# EAGLE schematic martinez (EAGLE 8.0.2)
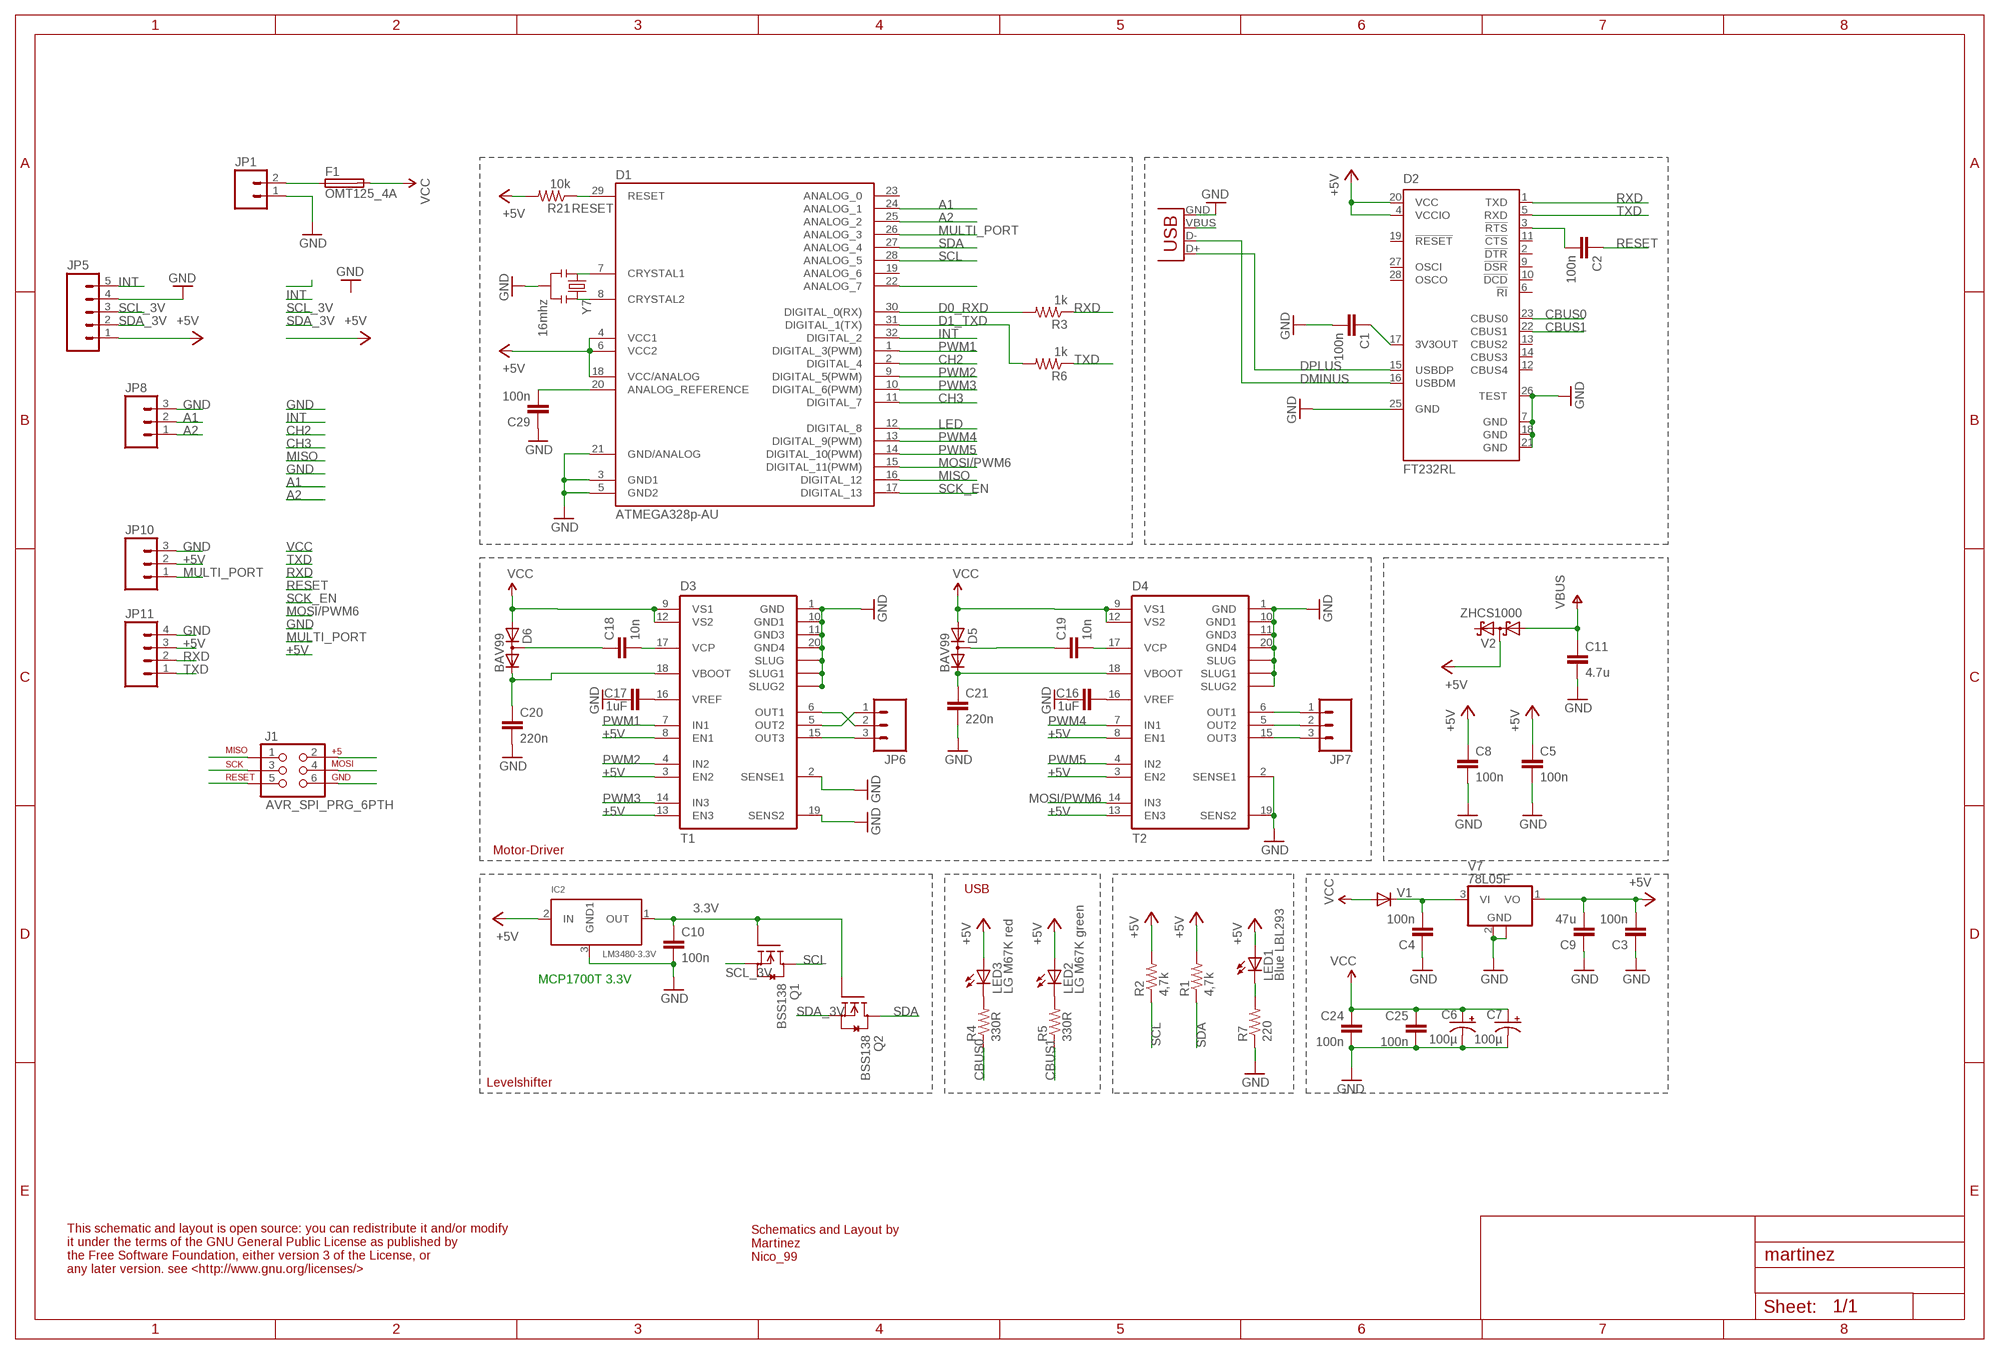
[diagram p0: schematic, sheet 1]

## Parts
C1  100n  CAP0805  [0805]
C2  100n  CAP0805  [0805]
C3  100n  CAP0805  [0805]
C4  100n  CAP0805  [0805]
C5  100n  CAP0805  [0805]
C6  100µ  CAP_POLD  [PANASONIC_D]
C7  100µ  CAP_POLD  [PANASONIC_D]
C8  100n  CAP0805  [0805]
C9  47u  C-EUC1210  [C1210]
C10  100n  CAP0805  [0805]
C11  4.7u  CAP0805  [0805]
C16  1uF  CAP0805  [0805]
C17  1uF  CAP0805  [0805]
C18  10n  CAP0805  [0805]
C19  10n  CAP0805  [0805]
C20  220n  CAP0805  [0805]
C21  220n  CAP0805  [0805]
C24  100n  CAP0805  [0805]
C25  100n  CAP0805  [0805]
C29  100n  CAP0805  [0805]
D1  ATMEGA328p-AU  ATMEGA168-AU  [TQFP32-08]
D2  FT232RL  [SSOP28]
D3  T1  L6234  [SO20POWER2]
D4  T2  L6234  [SO20POWER2]
D5  BAV99  BAV199  [SOT23]
D6  BAV99  BAV199  [SOT23]
F1  OMT125_4A  OMT125_11MM  [OMT125_11MM]
IC2  LM3480-3.3V  VREG_MULTI2  [SOT23]
J1  AVR_SPI_PRG_6PTH  [2X3]
JP1  M02PTH  [1X02]
JP5  M05PTH  [1X05]
JP6  M03PTH  [1X03]
JP7  M03PTH  [1X03]
JP8  M031X03_NO_SILK  [1X03_NO_SILK]
JP10  M031X03_NO_SILK  [1X03_NO_SILK]
JP11  M041X04_NO_SILK  [1X04_NO_SILK]
LED1  Blue LBL293  LEDCHIP-LED0603  [CHIP-LED0603]
LED2  LG M67K green  LEDCHIP-LED0805  [CHIP-LED0805]
LED3  LG M67K red  LEDCHIP-LED0805  [CHIP-LED0805]
Q1  BSS138  [SOT23]
Q2  BSS138  [SOT23]
R1  4,7k  RESISTOR0805-RES  [0805]
R2  4,7k  RESISTOR0805-RES  [0805]
R3  1k  RESISTOR0805-RES  [0805]
R4  330R  RESISTOR0805-RES  [0805]
R5  330R  RESISTOR0805-RES  [0805]
R6  1k  RESISTOR0805-RES  [0805]
R7  220  RESISTOR0805-RES  [0805]
R21  10k  RESISTOR0805-RES  [0805]
V1  DIODE-DO214AC  [DO214AC]
V2  ZHCS1000  BAS40-04  [SOT23]
V7  78L05F  [SOT89]
X2  USBOLD  [USB-MINIB-OLD]
Y7  16mhz  RESONATORSMD  [RESONATOR-SMD]

## Nets
3.3V: C10.1 IC2.1(OUT) Q1.1(G) Q2.1(G)
+5V: C3.2 C5.1 C8.1 C9.2 D1.4(VCC1) D1.6(VCC2) D1.18(VCC/ANALOG) D2.4(VCCIO) D2.20(VCC) D3.3(EN2) D3.8(EN1) D3.13(EN3) D4.3(EN2) D4.8(EN1) D4.13(EN3) IC2.2(IN) J1.2 JP5.1 JP10.2 JP11.3 LED1.A LED2.A LED3.A R1.2 R2.2 R21.2 V2.3(C1A2) V7.1(VO)
A1: D1.24(ANALOG_1) JP8.2
A2: D1.25(ANALOG_2) JP8.1
A7: D1.22(ANALOG_7)
CBUS0: D2.23(CBUS0) R4.1
CBUS1: D2.22(CBUS1) R5.1
CH2: D1.2(DIGITAL_4)
CH3: D1.11(DIGITAL_7)
D0_RXD: D1.30(DIGITAL_0(RX)) R3.2
D1_TXD: D1.31(DIGITAL_1(TX)) R6.2
DMINUS: D2.16(USBDM) X2.D-
DPLUS: D2.15(USBDP) X2.D+
GND: C1.2 C3.1 C4.1 C5.2 C6.- C7.- C8.2 C9.1 C10.2 C11.2 C16.1 C17.1 C20.2 C21.2 C24.2 C25.2 C29.1 D1.3(GND1) D1.5(GND2) D1.21(GND/ANALOG) D2.7(GND) D2.18(GND) D2.21(GND) D2.25(GND) D2.26(TEST) D3.1(GND) D3.2(SENSE1) D3.10(GND1) D3.11(GND3) D3.19(SENS2) D3.20(GND4) D3.SLUG1(SLUG2) D3.SLUG2(SLUG) D3.SLUG(SLUG1) D4.1(GND) D4.2(SENSE1) D4.10(GND1) D4.11(GND3) D4.19(SENS2) D4.20(GND4) D4.SLUG1(SLUG2) D4.SLUG2(SLUG) D4.SLUG(SLUG1) IC2.3(GND1) J1.6 JP1.1 JP5.4 JP8.3 JP10.3 JP11.4 R7.1 V7.2(GND) V7.2@1(GND) X2.GND Y7.2
INT: D1.32(DIGITAL_2) JP5.5
LED: D1.12(DIGITAL_8)
MISO: D1.16(DIGITAL_12) J1.1
MOSI/PWM6: D1.15(DIGITAL_11(PWM)) D4.14(IN3) J1.4
MULTI_PORT: D1.26(ANALOG_3) JP10.1
N$1: LED3.C R4.2
N$2: LED2.C R5.2
N$3: F1.P$1 JP1.2
N$4: LED1.C R7.2
N$7: C16.2 D4.16(VREF)
N$8: C17.2 D3.16(VREF)
N$17: C18.2 D3.17(VCP)
N$18: C19.2 D4.17(VCP)
N$19: C19.1 D5.3(AC)
N$20: C21.1 D4.18(VBOOT) D5.2(C)
N$21: D3.15(OUT3) JP6.3
N$22: C1.1 D2.17(3V3OUT)
N$23: D4.6(OUT1) JP7.1
N$24: D4.5(OUT2) JP7.2
N$25: D4.15(OUT3) JP7.3
N$26: C2.2 D2.3(!RTS)
N$27: D3.5(OUT2) JP6.1
N$28: D3.6(OUT1) JP6.2
N$38: D1.8(CRYSTAL2) Y7.3
N$39: D1.7(CRYSTAL1) Y7.1
N$40: C29.2 D1.20(ANALOG_REFERENCE)
PWM1: D1.1(DIGITAL_3(PWM)) D3.7(IN1)
PWM2: D1.9(DIGITAL_5(PWM)) D3.4(IN2)
PWM3: D1.10(DIGITAL_6(PWM)) D3.14(IN3)
PWM4: D1.13(DIGITAL_9(PWM)) D4.7(IN1)
PWM5: D1.14(DIGITAL_10(PWM)) D4.4(IN2)
RESET: C2.1 D1.29(RESET) J1.5 R21.1
RXD: D2.1(TXD) JP11.2 R3.1
SCK_EN: D1.17(DIGITAL_13) J1.3
SCL: D1.28(ANALOG_5) Q1.3(D) R2.1
SCL_3V: JP5.3 Q1.2(S)
SDA: D1.27(ANALOG_4) Q2.3(D) R1.1
SDA_3V: JP5.2 Q2.2(S)
TXD: D2.5(RXD) JP11.1 R6.1
VBOOT1: C20.1 D3.18(VBOOT) D6.2(C)
VBUS: C11.1 V2.1(A1) X2.VBUS
VCC: C6.+ C7.+ C24.1 C25.1 D3.9(VS1) D3.12(VS2) D4.9(VS1) D4.12(VS2) D5.1(A) D6.1(A) F1.P$2 V1.A
VCC_VI: C4.2 V1.C V7.3(VI)
VCP1: C18.1 D6.3(AC)
Unconnected: D1.19(ANALOG_6) D1.23(ANALOG_0) D2.2(!DTR) D2.6(!RI) D2.9(!DSR) D2.10(!DCD) D2.11(!CTS) D2.12(CBUS4) D2.13(CBUS2) D2.14(CBUS3) D2.19(!RESET) D2.27(OSCI) D2.28(OSCO) V2.2(C2)

## Notes on the sheet
- FTDI
- Motor-Driver
- USB
- MCP1700T 3.3V
- Levelshifter
- Schematics and Layout by
  Martinez
  Nico_99
- This schematic and layout is open source: you can redistribute it and/or modify
  it under the terms of the GNU General Public License as published by
  the Free Software Foundation, either version 3 of the License, or
  any later version. see <http://www.gnu.org/licenses/>

## Library data of the parts
C1-C5 C8 C10 C11 C16-C21 C24 C25 C29 = SparkFun:CAP: Capacitor Standard 0603 ceramic capacitor, and 0.1" leaded capacitor.
C6 C7 = SparkFun:CAP_POL: Capacitor Polarized These are standard SMD and PTH capacitors. Normally 10uF, 47uF, and 100uF in electrolytic and tantalum varieties. Always verify the external diameter of the through hole cap, it varies with capacity, voltage, and manufacturer. The EIA devices should be standard.
C9 = rcl:C-EU: CAPACITOR, European symbol
D1 = Arduino-AVR:ATMEGA168
D2 = ftdichip:FT232R: Source: http://www.ftdichip.com/Documents/DataSheets/DS_FT232R_v104.pdf; MPN: FT232RL; OC_FARNELL: 1146032; OC_NEWARK: 91K9918
D3 D4 = L6234:L6234
D5 D6 = diode:BAV199: DIODE low-leakage double diode
F1 = fuse:OMT125_11MM
IC2 = m-pad-2.1_my:VREG_MULTI2: standard package voltage regulator (LM3480, etc)
J1 = SparkFun:AVR_SPI_PRG_6: AVR ISP 6 Pin This is the reduced ISP connector for AVR programming. Common on Arduino. This footprint will take up less PCB space and can be used with a 10-pin to 6-pin adapter such as SKU: BOB-08508
JP1 = SparkFun:M02: Header 2 Standard 2-pin 0.1" header. Use with straight break away headers (SKU : PRT-00116), right angle break away headers (PRT-00553), swiss pins (PRT-00743), machine pins (PRT-00117), and female headers (PRT-00115). Molex polarized connector foot print use with SKU : PRT-08233 with associated crimp pins and housings.
JP5 = SparkFun:M05: Header 5 Standard 5-pin 0.1" header. Use with straight break away headers (SKU : PRT-00116), right angle break away headers (PRT-00553), swiss pins (PRT-00743), machine pins (PRT-00117), and female headers (PRT-00115). Molex polarized connector foot print use with SKU : PRT-08230 with associated crimp pins and housings.
JP6-JP8 JP10 = SparkFun:M03: Header 3 Standard 3-pin 0.1" header. Use with straight break away headers (SKU : PRT-00116), right angle break away headers (PRT-00553), swiss pins (PRT-00743), machine pins (PRT-00117), and female headers (PRT-00115). Molex polarized connector foot print use with SKU : PRT-08232 with associated crimp pins and housings.
JP11 = SparkFun:M04: Header 4 Standard 4-pin 0.1" header. Use with straight break away headers (SKU : PRT-00116), right angle break away headers (PRT-00553), swiss pins (PRT-00743), machine pins (PRT-00117), and female headers (PRT-00115). Molex polarized connector foot print use with SKU : PRT-08231 with associated crimp pins and housings. 1MM SMD Version SKU: PRT-10208
LED1-LED3 = led:LED: LED OSRAM: - CHIPLED LG R971, LG N971, LY N971, LG Q971, LY Q971, LO R971, LY R971 LH N974, LH R974 LS Q976, LO Q976, LY Q976 LO Q996 - Hyper CHIPLED LW Q18S LB Q993, LB Q99A, LB R99A - SideLED LS A670, LO A670, LY A670, LG A670, LP A670 LB A673, LV A673, LT A673, LW A673 LH A674 LY A675 LS A676, LA A676, LO A676, LY A676, LW A676 LS A679, LY A679, LG A679 - Hyper Micro SIDELED® LS Y876, LA Y876, LO Y876, LY Y876 LT Y87S - SmartLED LW L88C, LW L88S LB L89C, LB L89S, LG L890 LS L89K, LO L89K, LY L89K LS L896, LA L896, LO L896, LY L896 - TOPLED LS T670, LO T670, LY T670, LG T670, LP T670 LSG T670, LSP T670, LSY T670, LOP T670, LYG T670 LG T671, LOG T671, LSG T671 LB T673, LV T673, LT T673, LW T673 LH T674 LS T676, LA T676, LO T676, LY T676, LB T676, LH T676, LSB T676, LW T676 LB T67C, LV T67C, LT T67C, LS T67K, LO T67K, LY T67K, LW E67C LS E67B, LA E67B, LO E67B, LY E67B, LB E67C, LV E67C, LT E67C LW T67C LS T679, LY T679, LG T679 LS T770, LO T770, LY T770, LG T770, LP T770 LB T773, LV T773, LT T773, LW T773 LH T774 LS E675, LA E675, LY E675, LS T675 LS T776, LA T776, LO T776, LY T776, LB T776 LHGB T686 LT T68C, LB T68C - Hyper Mini TOPLED® LB M676 - Mini TOPLED Santana® LG M470 LS M47K, LO M47K, LY M47K Source: http://www.osram.convergy.de LUXEON: - LUMILED® LXK2-PW12-R00, LXK2-PW12-S00, LXK2-PW14-U00, LXK2-PW14-V00 LXK2-PM12-R00, LXK2-PM12-S00, LXK2-PM14-U00 LXK2-PE12-Q00, LXK2-PE12-R00, LXK2-PE12-S00, LXK2-PE14-T00, LXK2-PE14-U00 LXK2-PB12-K00, LXK2-PB12-L00, LXK2-PB12-M00, LXK2-PB14-N00, LXK2-PB14-P00, LXK2-PB14-Q00 LXK2-PR12-L00, LXK2-PR12-M00, LXK2-PR14-Q00, LXK2-PR14-R00 LXK2-PD12-Q00, LXK2-PD12-R00, LXK2-PD12-S00 LXK2-PH12-R00, LXK2-PH12-S00 LXK2-PL12-P00, LXK2-PL12-Q00, LXK2-PL12-R00 Source: www.luxeon.com KINGBRIGHT: KA-3528ASYC Source: www.kingbright.com
Q1 Q2 = m-pad-2.1_my:BSS138: Fairchild Semiconductors BSS138 N-Channel Logic Level Enhancement Mode Field Effect Transistor General Description: These N-Channel enhancement mode field effect transistors are produced using Fairchild's proprietary, high cell density, DMOS technology. These products have been designed to minimize on-state resistance while provide rugged, reliable, and fast switching performance.These products are particularly suited for low voltage, low current applications such as small servo motor control, power MOSFET gate drivers, and other switching applications. Features: 0.22 A, 50 V. RDS(ON) = 3.5Ohm @ VGS = 10 V RDS(ON) = 6.0Ohm @ VGS = 4.5 V High density cell design for extremely low RDS(ON) Rugged and Reliable Compact industry standard SOT-23 surface mount package Please send any comments to: messi@users.sourceforge.net
R1-R7 R21 = SparkFun:RESISTOR: Resistor Basic schematic elements and footprints for 0603, 1206, and PTH resistors.
V1 = diode:DIODE-: DIODE
V2 = diode:BAS40-04: Silicon Schottky Diodes General-purpose diode for high-speed switching
V7 = linear:78L*: POSITOIV-VOLTAGE REGULATORS Output up to 100 mA Source: http://focus.ti.com/lit/ds/symlink/ua78l05.pdf
X2 = SparkFun:USB: USB Connectors USB-B-PTH is fully proven SKU : PRT-00139 USB-miniB is fully proven SKU : PRT-00587 USB-A-PCB is untested. USB-A-H is throughly reviewed, but untested. Spark Fun Electronics SKU : PRT-00437 USB-B-SMT is throughly reviewed, but untested. Needs silkscreen touching up. USB-A-S has not been used/tested USB-MB-H has not been used/tested
Y7 = SparkFun:RESONATOR: Resonator Small SMD resonator. This is the itty bitty 10/20MHz resonators with built in caps. CSTCE10M0G55 and CSTCE20M0V53. Footprint has been reviewed closely but hasn't been tested yet.

## Net classes
0 default: width 0.152 mm, clearance 0.152 mm